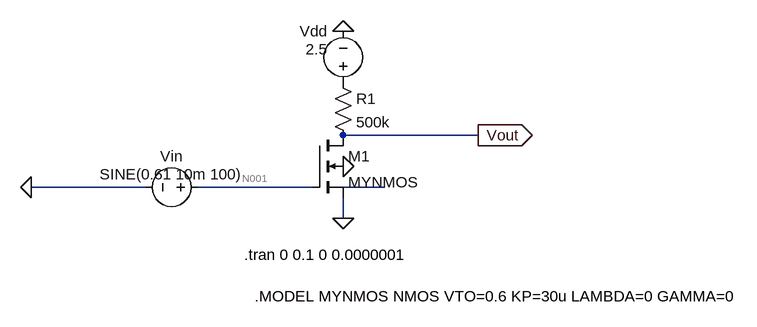
[diagram p0: schematic Lab 7 Fig 2f-1.asc]
Lab 7 Fig 2f-1.asc, the LTspice schematic file:
Version 4
SHEET 1 880 680
WIRE 288 160 80 160
WIRE -224 240 -400 240
WIRE 32 240 -144 240
WIRE 144 240 80 240
WIRE 80 288 80 256
FLAG 288 160 Vout
IOPIN 288 160 Out
FLAG 80 0 0
FLAG -400 240 0
FLAG 80 288 0
FLAG 80 208 0
SYMBOL res 64 64 R0
SYMATTR InstName R1
SYMATTR Value 500k
SYMBOL voltage 80 96 R180
WINDOW 0 24 96 Left 2
WINDOW 3 24 68 Left 2
WINDOW 123 0 0 Left 0
WINDOW 39 0 0 Left 0
SYMATTR InstName Vdd
SYMATTR Value 2.5
SYMBOL voltage -128 240 R90
WINDOW 0 -32 56 VBottom 2
WINDOW 3 -4 56 VBottom 2
WINDOW 123 0 0 Left 0
WINDOW 39 0 0 Left 0
SYMATTR InstName Vin
SYMATTR Value SINE(0.61 10m 100)
SYMBOL nmos4 32 160 R0
SYMATTR InstName M1
SYMATTR Value MYNMOS
SYMATTR Value2 l=1u w=100u
TEXT -72 344 Left 2 !.tran 0 0.1 0 0.0000001
TEXT -56 408 Left 2 !.MODEL MYNMOS NMOS VTO=0.6 KP=30u LAMBDA=0 GAMMA=0

The netlist it stands for:
* Lab 7 Fig 2f-1.asc
R1 P001 Vout 500k
Vdd P001 0 2.5
Vin N001 0 SINE(0.61 10m 100)
M1 Vout N001 0 0 MYNMOS l=1u w=100u
.model NMOS NMOS
.model PMOS PMOS
.lib standard.mos
.tran 0 0.1 0 0.0000001
.MODEL MYNMOS NMOS VTO=0.6 KP=30u LAMBDA=0 GAMMA=0
.backanno
.end

* Results of the author's LTspice run, read from the files saved beside the schematic
* Operating Point, zero values left out:
*   V(p001) = 2.5 V
*   V(vout) = 2.425 V
*   V(n001) = 610 mV
*   Id(M1) = 150 nA
*   Ib(M1) = -2.435 pA
*   Is(M1) = -150 nA
*   I(R1) = 150 nA
*   I(Vdd) = -150 nA
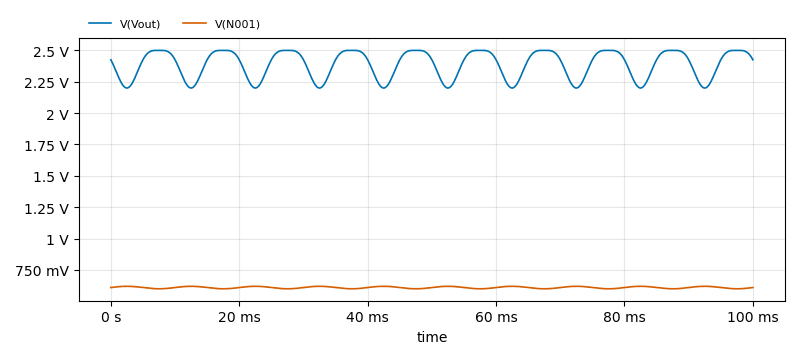
[diagram p1: Transient Analysis of Lab 7 Fig 2f-1.asc, plotted from the saved traces]
* Transient Analysis, 1 run:
*   V(Vout): min 2.2 V, max 2.5 V, average 2.387 V, rms 2.39 V, last 2.425 V
*   V(N001): min 600 mV, max 620 mV, average 610 mV, rms 610 mV, last 610 mV